# EAGLE schematic rapidshark_mark_6.2 (EAGLE 6.5.0)
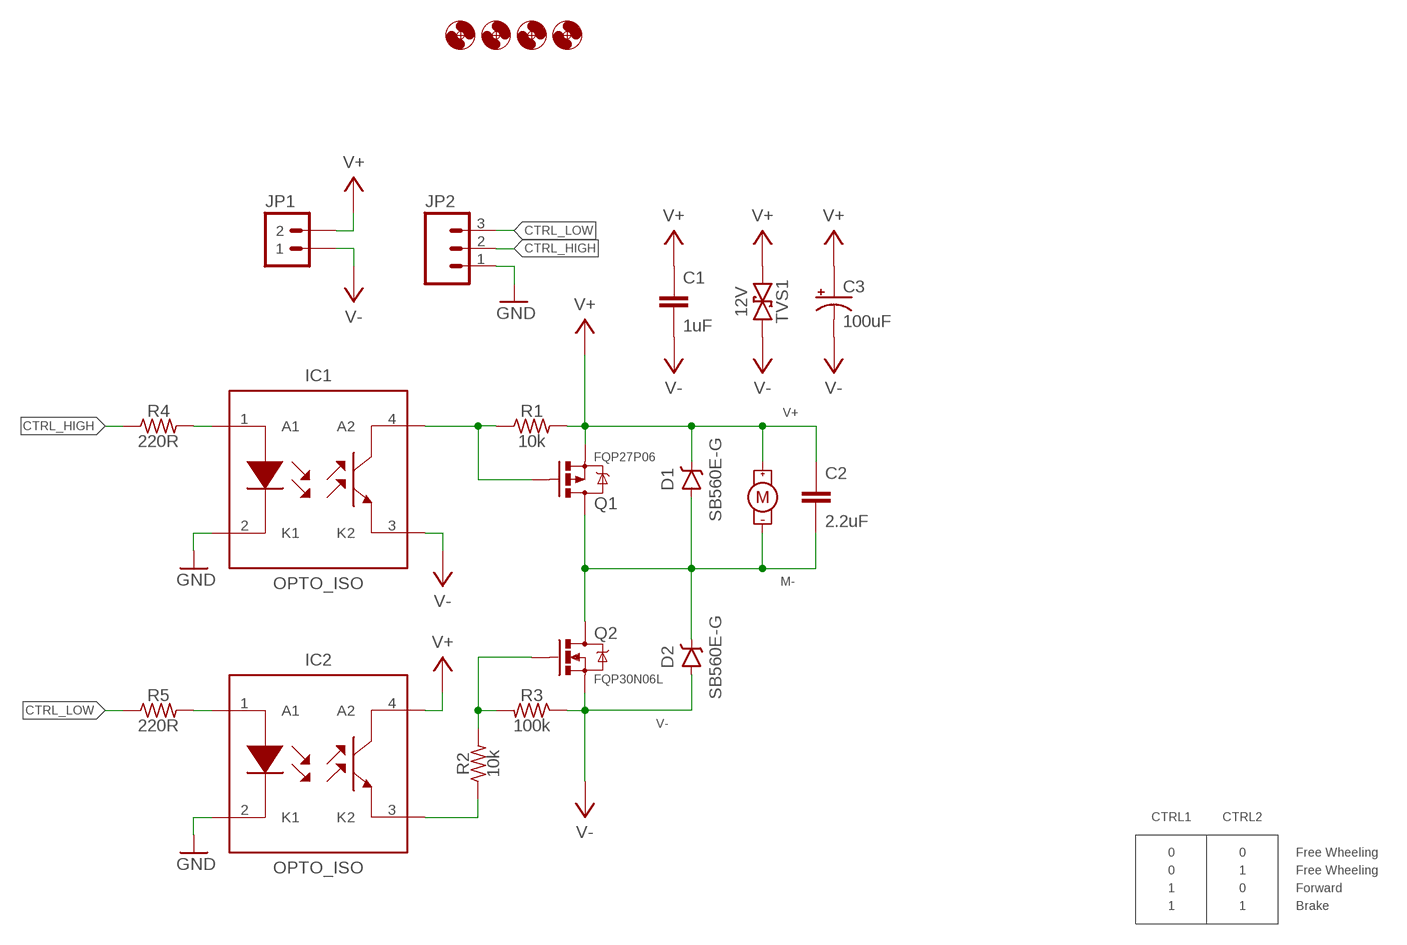
[diagram p0: schematic, sheet 1]

## Parts
C1  1uF  CAPACITOR-CERAMIC025-024X044  [C025-024X044]
C2  2.2uF  CAPACITOR-CERAMIC050-025X075  [C050-025X075]
C3  100uF  CAPACITOR-POLARIZEDE2.5-6-FLAT  [E2.5-6-FLAT]
D1  SB560E-G  DIODE-SCHOTTKYPTH-12.70-FAT  [DIODE-12.70MM-FAT]
D2  SB560E-G  DIODE-SCHOTTKYPTH-12.70-FAT  [DIODE-12.70MM-FAT]
H1  HOLE#2  [HOLE-#2]
H2  HOLE#2  [HOLE-#2]
H3  HOLE#2  [HOLE-#2]
H4  HOLE#2  [HOLE-#2]
IC1  OPTO_ISO  OPTOISOLATORDIP4  [DIL04]
IC2  OPTO_ISO  OPTOISOLATORDIP4  [DIL04]
JP1  M02PTH4  [1X02_XTRA_BIG]
JP2  M03JST-PTH  [JST-3-PH-RA-PTH]
M1  MOTORXTRA-BIG  [1X02_XTRA_BIG]
Q1  FQP27P06  MOSFET-PCHANNELFQP27P06-FLAT  [TO-220-SIDE-THERM-ALT]
Q2  FQP30N06L  MOSFET-NCHANNELFQP30N06L-THERM  [TO-220-SIDE-THERM-ALT]
R1  10k  RESISTORPTH-AXIAL-7.62MM  [RESISTOR-AXIAL-PTH-7.62MM]
R2  10k  RESISTORPTH-AXIAL-7.62MM  [RESISTOR-AXIAL-PTH-7.62MM]
R3  100k  RESISTORPTH-AXIAL-7.62MM  [RESISTOR-AXIAL-PTH-7.62MM]
R4  220R  RESISTORPTH-AXIAL-6.35MM  [RESISTOR-AXIAL-PTH-6.35MM]
R5  220R  RESISTORPTH-AXIAL-6.35MM  [RESISTOR-AXIAL-PTH-6.35MM]
TVS1  12V  TVSDO-41-10.16MM  [DO-41-TVS-BI-10.16MM]

## Nets
CTRL_HIGH: JP2.2 R4.P$1
CTRL_LOW: JP2.3 R5.P$1
GND: IC1.2(K1) IC2.2(K1) JP2.1
M-: C2.2 D1.A D2.K(C) M1.2(-) Q1.2(D) Q1.GND@1(D) Q1.GND@2(D) Q1.GND@3(D) Q1.GND@4(D) Q1.GND@5(D) Q1.GND@6(D) Q1.GND@7(D) Q1.GND@8(D) Q1.GND@9(D) Q1.GND@10(D) Q1.GND@11(D) Q1.GND@12(D) Q1.GND@13(D) Q1.GND@14(D) Q1.GND@15(D) Q1.GND@16(D) Q1.GND@17(D) Q1.GND@18(D) Q1.GND@19(D) Q1.GND@20(D) Q1.GND@21(D) Q1.GND@22(D) Q1.GND@23(D) Q1.GND@24(D) Q1.GND@25(D) Q1.GND@26(D) Q1.GND@27(D) Q2.2(D) Q2.GND@1(D) Q2.GND@2(D) Q2.GND@3(D) Q2.GND@4(D) Q2.GND@5(D) Q2.GND@6(D) Q2.GND@7(D) Q2.GND@8(D) Q2.GND@9(D) Q2.GND@10(D) Q2.GND@11(D) Q2.GND@12(D) Q2.GND@13(D) Q2.GND@14(D) Q2.GND@15(D) Q2.GND@16(D) Q2.GND@17(D) Q2.GND@18(D) Q2.GND@19(D) Q2.GND@20(D) Q2.GND@21(D) Q2.GND@22(D) Q2.GND@23(D) Q2.GND@24(D) Q2.GND@25(D) Q2.GND@26(D) Q2.GND@27(D)
N$2: IC1.4(A2) Q1.1(G) R1.P$1
N$3: Q2.1(G) R2.P$2 R3.P$2
N$4: IC1.1(A1) R4.P$2
N$6: IC2.1(A1) R5.P$2
N$7: IC2.3(K2) R2.P$1
V+: C1.1 C2.1 C3.+ D1.K(C) IC2.4(A2) JP1.2 M1.1(+) Q1.3(S) R1.P$2 TVS1.P$1
V-: C1.2 C3.- D2.A IC1.3(K2) JP1.1 Q2.3(S) R3.P$1 TVS1.P$2

## Notes on the sheet
- CTRL1 | CTRL2
- 0 | 0 | Free Wheeling
- 0 | 1 | Free Wheeling
- 1 | 0 | Forward
- 1 | 1 | Brake

## Library data of the parts
C1 C2 = A_butts:CAPACITOR-CERAMIC: CAPACITOR, European symbol
C3 = A_butts:CAPACITOR-POLARIZED: POLARIZED CAPACITOR, American symbol
D1 D2 = A_butts:DIODE-SCHOTTKY: Schottky diodes in SFE's production catalog BAT20J 1A 23V 0.62Vf RB751 120mA 40V 0.37Vf PMEG4005EJ 0.5A 40V 0.42Vf MBRA140 1A 40V 0.5Vf B340A 3A 40V SMA
H1-H4 = A_butts:HOLE: MOUNTING HOLE with drill center marker
IC1 IC2 = A_butts:OPTOISOLATOR
JP1 = A_butts:M02: Standard 2-pin 0.1" header. Use with - straight break away headers ( PRT-00116) - right angle break away headers (PRT-00553) - swiss pins (PRT-00743) - machine pins (PRT-00117) - female headers (PRT-00115) Molex polarized connector foot print use with: PRT-08233 with associated crimp pins and housings. 2.54_SCREWTERM for use with PRT-10571. 3.5mm Screw Terminal footprints for PRT-08084 5mm Screw Terminal footprints for use with PRT-08433
JP2 = A_butts:M03: Header 3 Standard 3-pin 0.1" header. Use with straight break away headers (SKU : PRT-00116), right angle break away headers (PRT-00553), swiss pins (PRT-00743), machine pins (PRT-00117), and female headers (PRT-00115). Molex polarized connector foot print use with SKU : PRT-08232 with associated crimp pins and housings.; SKU: PRT-09915
M1 = A_butts:MOTOR: Brushed DC Motor Symbol for a motor combined with screw terminal output pads for hookup (since it's unlikely you're soldering the motor itself to a board :P).
Q1 = A_butts:MOSFET-PCHANNEL: Generic PMOSFET IRLML2244 - TRANS-11153 (SOT-23 -20V -4.3A) (1.Gate 2.Source 3.Drain) FQP27P06 - COM-10349 <http://www.sparkfun.com/products/10349> (TO-220 -60V -27A) (1.Gate 2.Source 3.Drain)
Q2 = A_butts:MOSFET-NCHANNEL: Common NMOSFET Parts MFG P/N Store ID Prod ID FDD8780 TRANS-09984 SI7820DN TRANS-11055 FDS6630A IC-08089 2N7002PW TRANS-11151 FQP30N06L COM-10213 TRANS-10060 BSS123LT1G TRANS-08345 BSS138 TRANS-00830 BS170 2N7000
R1-R5 = A_butts:RESISTOR: RESISTOR, American symbol
TVS1 = A_butts:TVS: Transient voltage suppressor- prevents ESD on inputs. Ignore package description- MBRA140 is NOT this type of part!!!